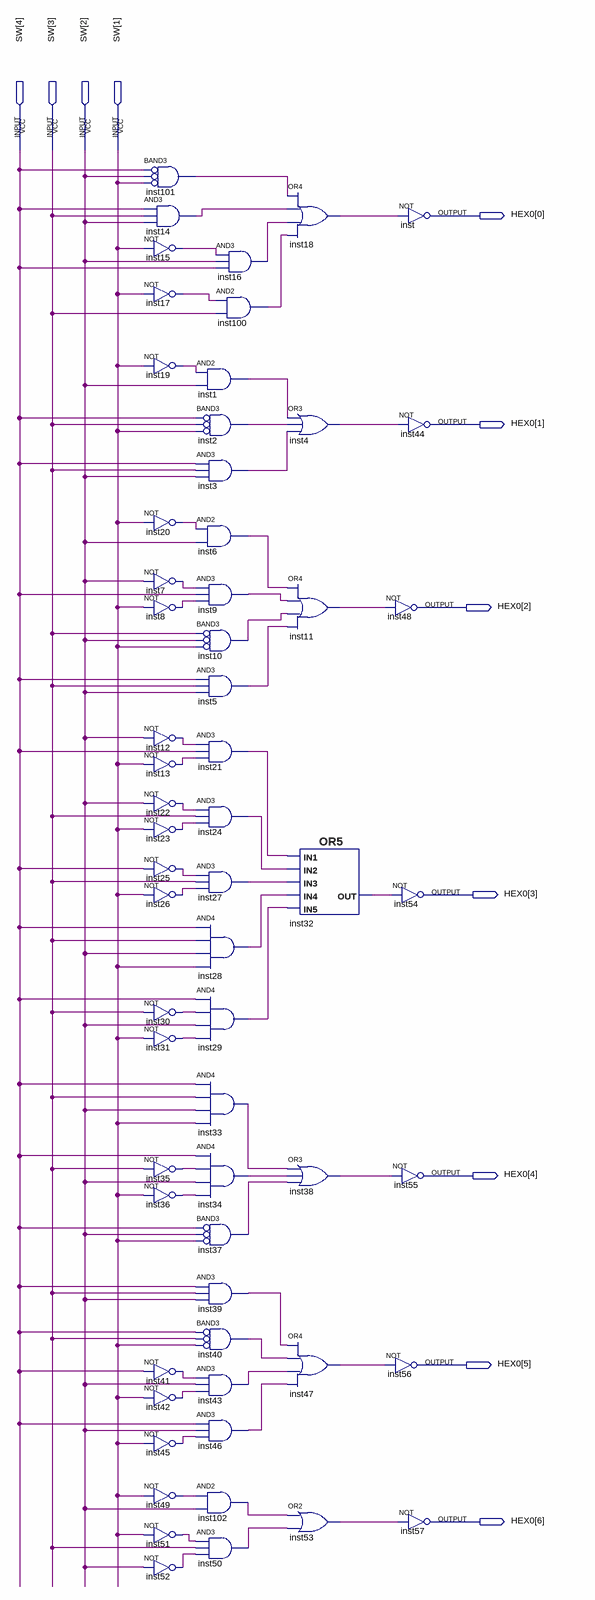
[diagram p0: schematic sheet]
// Quartus schematic Projeto2.bdf as structural Verilog: 61 symbols, 11 pins
module Projeto2 (
  input  [4:1] SW,
  output [6:0] HEX0
);

  wire inst1_out, inst2_out, inst3_out, inst4_out, inst5_out, inst6_out, inst7_out, inst8_out, inst9_out,
       inst10_out, inst11_out, inst12_out, inst13_out, inst14_out, inst15_out, inst16_out, inst17_out,
       inst18_out, inst19_out, inst20_out, inst21_out, inst22_out, inst23_out, inst24_out, inst25_out,
       inst26_out, inst27_out, inst28_out, inst29_out, inst30_out, inst31_out, inst32_out, inst33_out,
       inst34_out, inst35_out, inst36_out, inst37_out, inst38_out, inst39_out, inst40_out, inst41_out,
       inst42_out, inst43_out, inst45_out, inst46_out, inst47_out, inst49_out, inst50_out, inst51_out,
       inst52_out, inst53_out, inst100_out, inst101_out, inst102_out;

  and inst101 (inst101_out, ~SW[4], ~SW[2], ~SW[1]);  // BAND3
  and inst14 (inst14_out, SW[4], SW[3], SW[2]);
  not inst15 (inst15_out, SW[1]);
  not inst17 (inst17_out, SW[1]);
  not inst19 (inst19_out, SW[1]);
  not inst20 (inst20_out, SW[1]);
  not inst7 (inst7_out, SW[2]);
  not inst8 (inst8_out, SW[1]);
  not inst12 (inst12_out, SW[2]);
  not inst13 (inst13_out, SW[1]);
  not inst22 (inst22_out, SW[2]);
  not inst23 (inst23_out, SW[1]);
  not inst25 (inst25_out, SW[4]);
  not inst26 (inst26_out, SW[1]);
  not inst30 (inst30_out, SW[3]);
  not inst31 (inst31_out, SW[1]);
  not inst35 (inst35_out, SW[3]);
  not inst36 (inst36_out, SW[1]);
  not inst41 (inst41_out, SW[4]);
  not inst42 (inst42_out, SW[1]);
  not inst45 (inst45_out, SW[1]);
  not inst49 (inst49_out, SW[1]);
  not inst51 (inst51_out, SW[1]);
  not inst52 (inst52_out, SW[2]);
  and inst1 (inst1_out, inst19_out, SW[2]);
  and inst2 (inst2_out, ~SW[4], ~SW[3], ~SW[1]);  // BAND3
  and inst3 (inst3_out, SW[4], SW[3], SW[2]);
  and inst6 (inst6_out, inst20_out, SW[2]);
  and inst9 (inst9_out, inst7_out, SW[4], inst8_out);
  and inst10 (inst10_out, ~SW[3], ~SW[2], ~SW[1]);  // BAND3
  and inst5 (inst5_out, SW[4], SW[3], SW[2]);
  and inst21 (inst21_out, inst12_out, SW[4], inst13_out);
  and inst24 (inst24_out, inst22_out, SW[3], inst23_out);
  and inst27 (inst27_out, inst25_out, SW[3], inst26_out);
  and inst28 (inst28_out, SW[4], SW[3], SW[2], SW[1]);
  and inst29 (inst29_out, SW[4], inst30_out, SW[2], inst31_out);
  and inst33 (inst33_out, SW[4], SW[3], SW[2], SW[1]);
  and inst34 (inst34_out, SW[4], inst35_out, SW[2], inst36_out);
  and inst37 (inst37_out, ~SW[4], ~SW[2], ~SW[1]);  // BAND3
  and inst39 (inst39_out, SW[4], SW[3], SW[2]);
  and inst40 (inst40_out, ~SW[4], ~SW[3], ~SW[1]);  // BAND3
  and inst43 (inst43_out, inst41_out, SW[2], inst42_out);
  and inst46 (inst46_out, SW[4], SW[2], inst45_out);
  and inst102 (inst102_out, inst49_out, SW[2]);
  and inst50 (inst50_out, inst51_out, SW[3], inst52_out);
  and inst16 (inst16_out, inst15_out, SW[2], SW[4]);
  and inst100 (inst100_out, inst17_out, SW[3]);
  or inst18 (inst18_out, inst101_out, inst14_out, inst16_out, inst100_out);
  or inst4 (inst4_out, inst1_out, inst2_out, inst3_out);
  or inst11 (inst11_out, inst6_out, inst9_out, inst10_out, inst5_out);
  or inst32 (inst32_out, inst21_out, inst24_out, inst27_out, inst28_out, inst29_out);
  or inst38 (inst38_out, inst33_out, inst34_out, inst37_out);
  or inst47 (inst47_out, inst39_out, inst40_out, inst43_out, inst46_out);
  or inst53 (inst53_out, inst102_out, inst50_out);
  not inst (HEX0[0], inst18_out);
  not inst44 (HEX0[1], inst4_out);
  not inst48 (HEX0[2], inst11_out);
  not inst54 (HEX0[3], inst32_out);
  not inst55 (HEX0[4], inst38_out);
  not inst56 (HEX0[5], inst47_out);
  not inst57 (HEX0[6], inst53_out);
endmodule
